# EAGLE design YAPM (EAGLE 6.3)
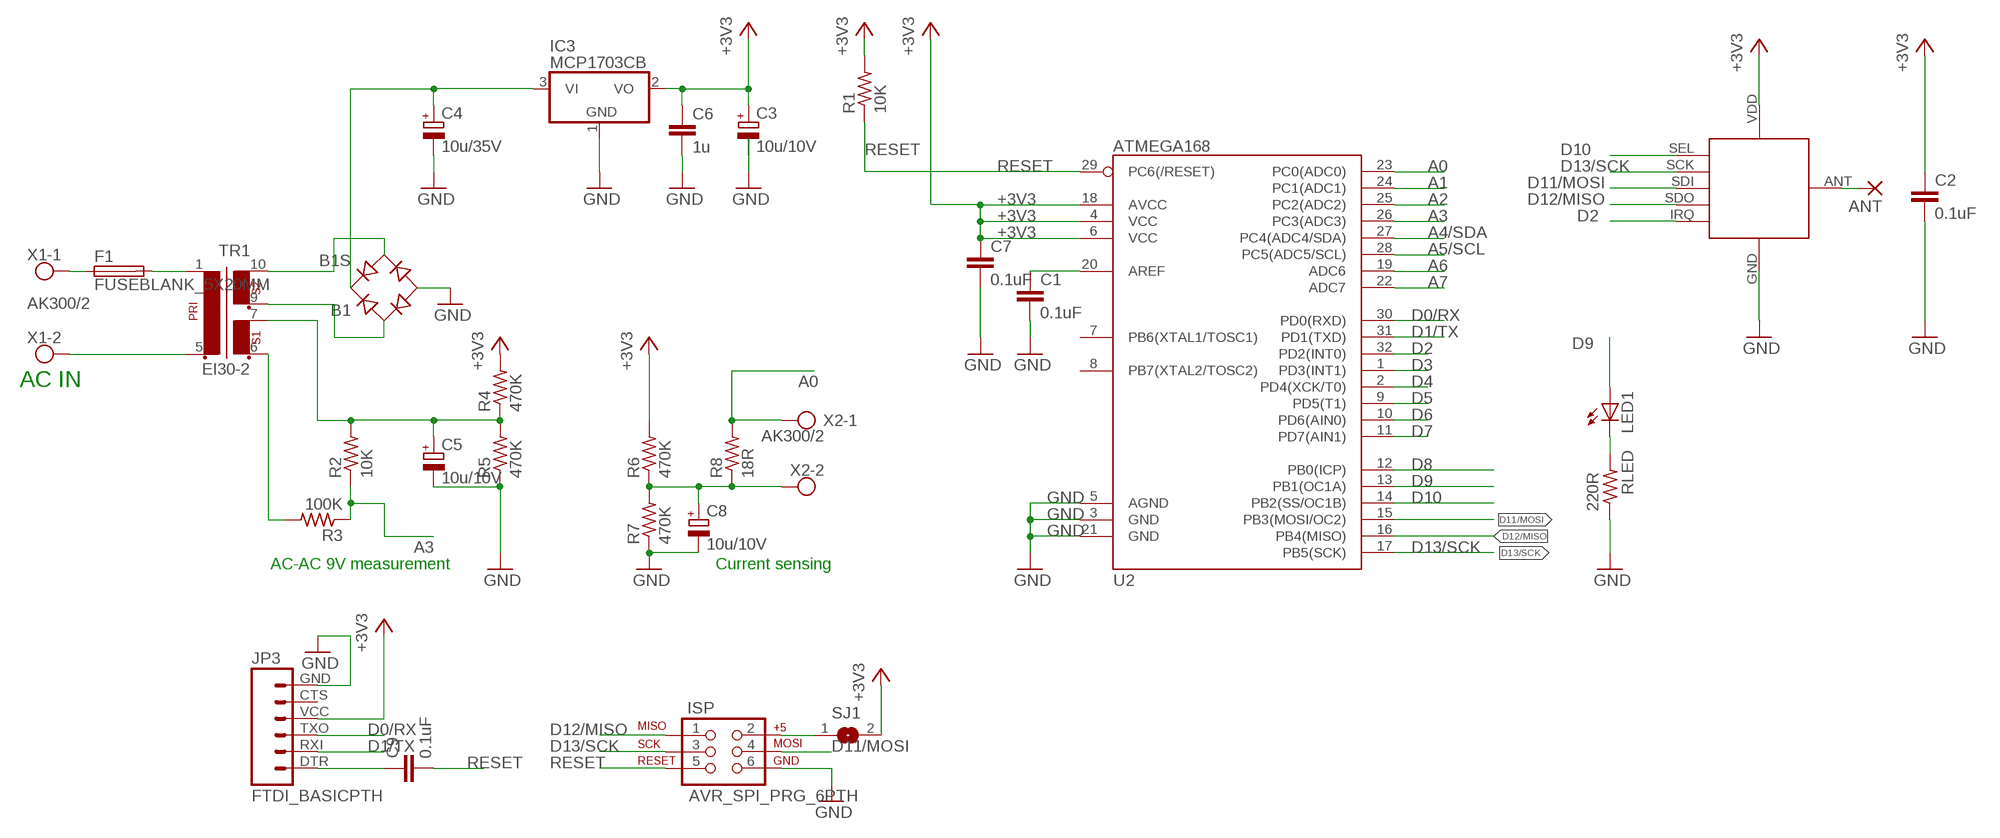
[diagram p0: schematic, sheet 1]

## Parts
ANT  1,6/0,8  [1,6/0,8]
B1  B1S  [MBS]
C1  0.1uF  C-EUC0603  [C0603]
C2  0.1uF  C-EUC0603  [C0603]
C3  10u/10V  CPOL-EUSMCA  [SMC_A]
C4  10u/35V  CPOL-EUSMCC  [SMC_C]
C5  10u/10V  CPOL-EUSMCA  [SMC_A]
C6  1u  C-EUC0603K  [C0603K]
C7  0.1uF  C-EUC0603  [C0603]
C8  10u/10V  CPOL-EUSMCA  [SMC_A]
C9  0.1uF  C-EUC0603  [C0603]
F1  FUSEBLANK_5X20MM  [FUSE_HOLDER_5X20MM]
IC3  MCP1703CB  [SOT23]
ISP  AVR_SPI_PRG_6PTH  [2X3]
JP3  FTDI_BASICPTH  [FTDI_BASIC]
LED1  LEDSML0603  [SML0603]
R1  10K  R-US_R0603  [R0603]
R2  10K  R-US_R0603  [R0603]
R3  100K  R-US_R0603  [R0603]
R4  470K  R-US_R0603  [R0603]
R5  470K  R-US_R0603  [R0603]
R6  470K  R-US_R0603  [R0603]
R7  470K  R-US_R0603  [R0603]
R8  18R  R-US_R0603  [R0603]
RFM12B1  RFM12B_MINPADS  [RFM12B-MINPADS]
RLED  220R  R-US_R0603  [R0603]
SJ1  SJ  [SJ]
TR1  EI30-2  [EI30-2]
U2  ATMEGA168  [TQFP32-08]
X1  AK300/2  [AK300/2]
X2  AK300/2  [AK300/2]

## Nets
+3V3 [power]: C2.1 C3.+ C6.1 C7.1 IC3.2(VO) JP3.VCC R1.2 R4.2 R6.2 RFM12B1.VDD SJ1.2 U2.4(VCC) U2.6(VCC) U2.18(AVCC)
+5V: ISP.2 SJ1.1
A0 [power]: R8.2 U2.23(PC0(ADC0)) X2.1
A1: U2.24(PC1(ADC1))
A2: U2.25(PC2(ADC2))
A3: R2.1 R3.1 U2.26(PC3(ADC3))
A4/SDA: U2.27(PC4(ADC4/SDA))
A5/SCL: U2.28(PC5(ADC5/SCL))
A6: U2.19(ADC6)
A7: U2.22(ADC7)
D0/RX: JP3.TXO U2.30(PD0(RXD))
D1/TX: JP3.RXI U2.31(PD1(TXD))
D2: RFM12B1.IRQ U2.32(PD2(INT0))
D3: U2.1(PD3(INT1))
D4: U2.2(PD4(XCK/T0))
D5: U2.9(PD5(T1))
D6: U2.10(PD6(AIN0))
D7: U2.11(PD7(AIN1))
D8: U2.12(PB0(ICP))
D9: LED1.A U2.13(PB1(OC1A))
D10: RFM12B1.SEL U2.14(PB2(SS/OC1B))
D11/MOSI: ISP.4 RFM12B1.SDI(SDI/MOSI) U2.15(PB3(MOSI/OC2))
D12/MISO: ISP.1 RFM12B1.SDO(SDO/MISO) U2.16(PB4(MISO))
D13/SCK: ISP.3 RFM12B1.SCK U2.17(PB5(SCK))
GND [power]: B1.- C1.2 C2.2 C3.- C4.- C5.- C6.2 C7.2 C8.- IC3.1(GND) ISP.6 JP3.GND R5.1 R7.1 RFM12B1.GND RLED.1 U2.3(GND) U2.5(AGND) U2.21(GND)
N$1 [220V]: F1.2 TR1.1
N$2 [220V]: F1.1 X1.1
N$3 [power]: B1.AC2 TR1.10
N$4 [power]: B1.AC1 TR1.9
N$5 [power]: B1.+ C4.+ IC3.3(VI)
N$6: C1.1 U2.20(AREF)
N$7 [power]: ANT.1(P) RFM12B1.ANT
N$8: LED1.C RLED.2
N$10 [power]: C8.+ R6.1 R7.2 R8.1 X2.2
N$11: C9.1 JP3.DTR
N$16 [power]: C5.+ R2.2 R4.1 R5.2 TR1.7
N$21 [power]: R3.2 TR1.6
N$27 [220V]: TR1.5 X1.2
RESET: C9.2 ISP.5 R1.1 U2.29(PC6(/RESET))
Unconnected: JP3.CTS U2.7(PB6(XTAL1/TOSC1)) U2.8(PB7(XTAL2/TOSC2))

## Notes on the sheet
- AC IN
- AC-AC 9V measurement | Current sensing

## Library data of the parts
ANT = JeeLabs:1,6/0,8: THROUGH-HOLE PAD
B1 = rectifier:B*S: Surface Mount Glass Passivated Bridge Rectifiers Source: Comchip Bridge Rectifiers B05S-G_B10S-G.pdf
C1 C7 C9 = resistor:C-EU: CAPACITOR, European symbol
C2 C6 = rcl:C-EU: CAPACITOR, European symbol
C3-C5 C8 = rcl:CPOL-EU: POLARIZED CAPACITOR, European symbol
F1 = fuse:FUSE: Fuse; OC_FARNELL: unknown; OC_NEWARK: unknown
IC3 = linear:MCP1703: 250 mA, 16V, Low Quiescent Current LDO Regulator Source: http://ww1.microchip.com/downloads/en/DeviceDoc/22049b.pdf
ISP = SparkFun:AVR_SPI_PRG_6: AVR ISP 6 Pin This is the reduced ISP connector for AVR programming. Common on Arduino. This footprint will take up less PCB space and can be used with a 10-pin to 6-pin adapter such as SKU: BOB-08508
JP3 = SparkFun:FTDI_BASIC: FTDI Basic: 3.3V and 5V
LED1 = led:LED: LED OSRAM: - CHIPLED LG R971, LG N971, LY N971, LG Q971, LY Q971, LO R971, LY R971 LH N974, LH R974 LS Q976, LO Q976, LY Q976 LO Q996 - Hyper CHIPLED LW Q18S LB Q993, LB Q99A, LB R99A - SideLED LS A670, LO A670, LY A670, LG A670, LP A670 LB A673, LV A673, LT A673, LW A673 LH A674 LY A675 LS A676, LA A676, LO A676, LY A676, LW A676 LS A679, LY A679, LG A679 - Hyper Micro SIDELED® LS Y876, LA Y876, LO Y876, LY Y876 LT Y87S - SmartLED LW L88C, LW L88S LB L89C, LB L89S, LG L890 LS L89K, LO L89K, LY L89K LS L896, LA L896, LO L896, LY L896 - TOPLED LS T670, LO T670, LY T670, LG T670, LP T670 LSG T670, LSP T670, LSY T670, LOP T670, LYG T670 LG T671, LOG T671, LSG T671 LB T673, LV T673, LT T673, LW T673 LH T674 LS T676, LA T676, LO T676, LY T676, LB T676, LH T676, LSB T676, LW T676 LB T67C, LV T67C, LT T67C, LS T67K, LO T67K, LY T67K, LW E67C LS E67B, LA E67B, LO E67B, LY E67B, LB E67C, LV E67C, LT E67C LW T67C LS T679, LY T679, LG T679 LS T770, LO T770, LY T770, LG T770, LP T770 LB T773, LV T773, LT T773, LW T773 LH T774 LS E675, LA E675, LY E675, LS T675 LS T776, LA T776, LO T776, LY T776, LB T776 LHGB T686 LT T68C, LB T68C - Hyper Mini TOPLED® LB M676 - Mini TOPLED Santana® LG M470 LS M47K, LO M47K, LY M47K Source: http://www.osram.convergy.de LUXEON: - LUMILED® LXK2-PW12-R00, LXK2-PW12-S00, LXK2-PW14-U00, LXK2-PW14-V00 LXK2-PM12-R00, LXK2-PM12-S00, LXK2-PM14-U00 LXK2-PE12-Q00, LXK2-PE12-R00, LXK2-PE12-S00, LXK2-PE14-T00, LXK2-PE14-U00 LXK2-PB12-K00, LXK2-PB12-L00, LXK2-PB12-M00, LXK2-PB14-N00, LXK2-PB14-P00, LXK2-PB14-Q00 LXK2-PR12-L00, LXK2-PR12-M00, LXK2-PR14-Q00, LXK2-PR14-R00 LXK2-PD12-Q00, LXK2-PD12-R00, LXK2-PD12-S00 LXK2-PH12-R00, LXK2-PH12-S00 LXK2-PL12-P00, LXK2-PL12-Q00, LXK2-PL12-R00 Source: www.luxeon.com KINGBRIGHT: KA-3528ASYC Source: www.kingbright.com
R1-R8 RLED = adafruit:R-US_: RESISTOR, American symbol
RFM12B1 = LowPowerLab:RFM12B_MINPADS
SJ1 = jumper:SJ: SMD solder JUMPER
TR1 = trafo:EI30-2: TRANSFORMER 1 primary winding, 2 secondary windings ERA
U2 = SparkFun:ATMEGA168
X1 X2 = con-ptr500:AK300/2: CONNECTOR; OC_FARNELL: unknown; OC_NEWARK: unknown

## Net classes
0 default: width 0.203 mm, drill 0.6 mm, clearance 0.203 mm
1 power: width 0.381 mm, drill 0.6 mm, clearance 0.305 mm
2 220V: width 2.032 mm, drill 0.8 mm, clearance 2.032 mm

## Board
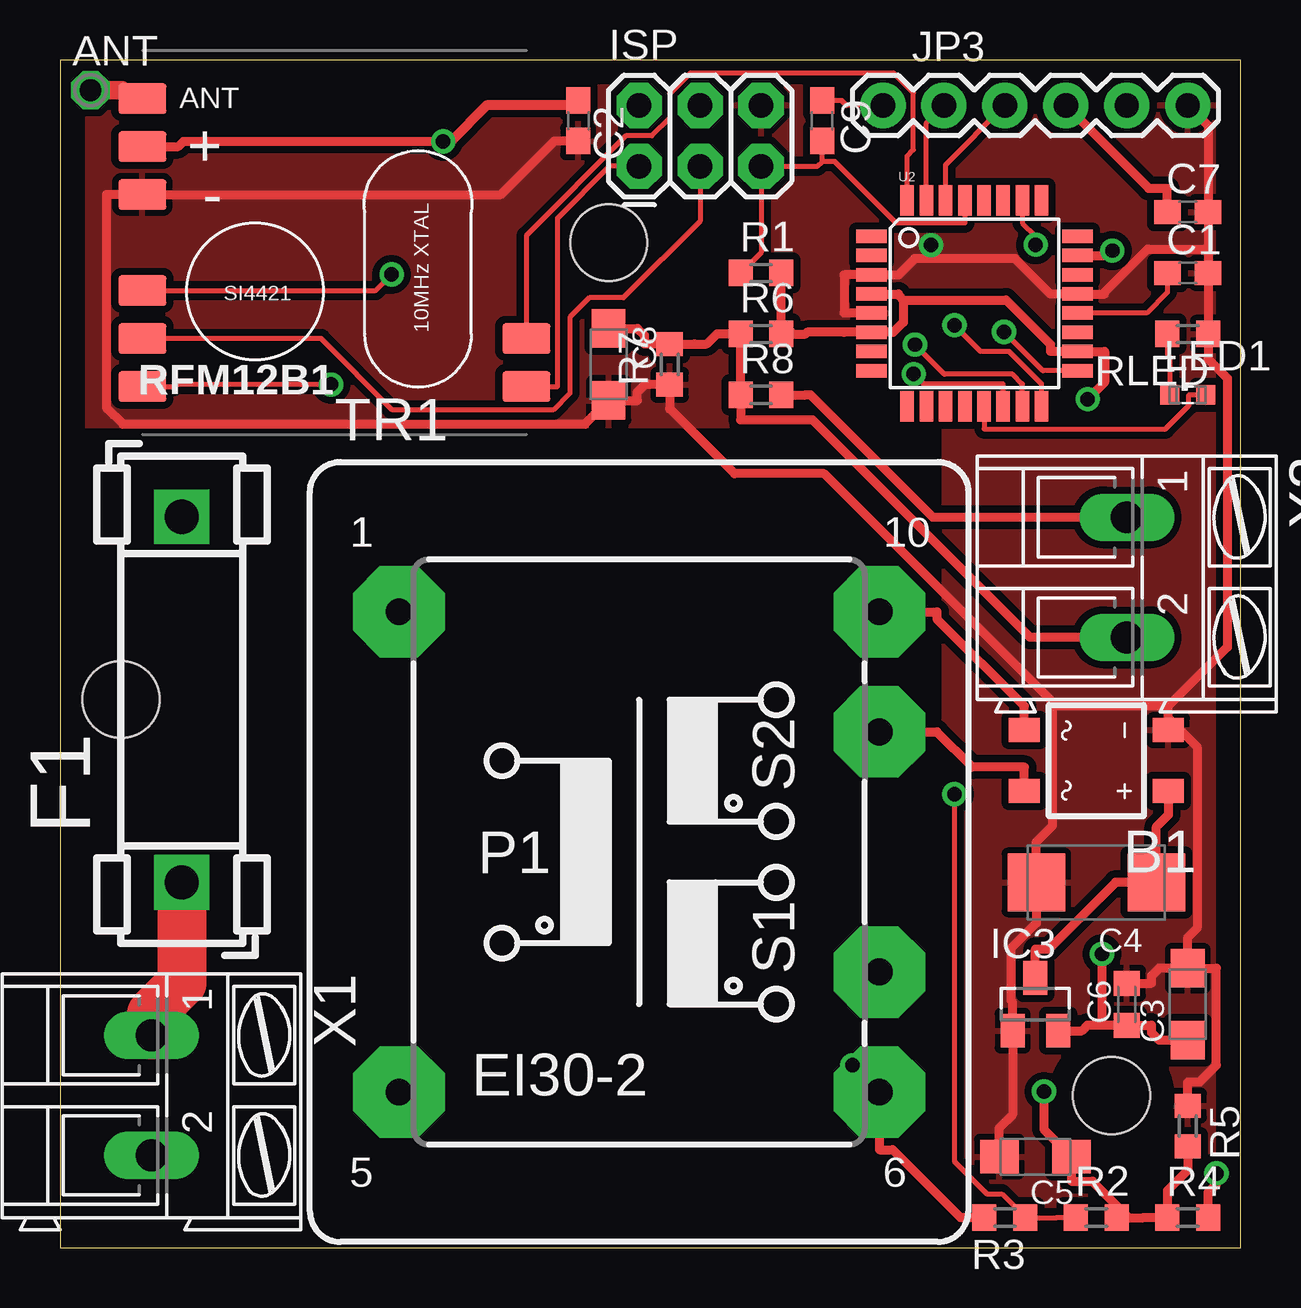
[diagram p1: board, top side]
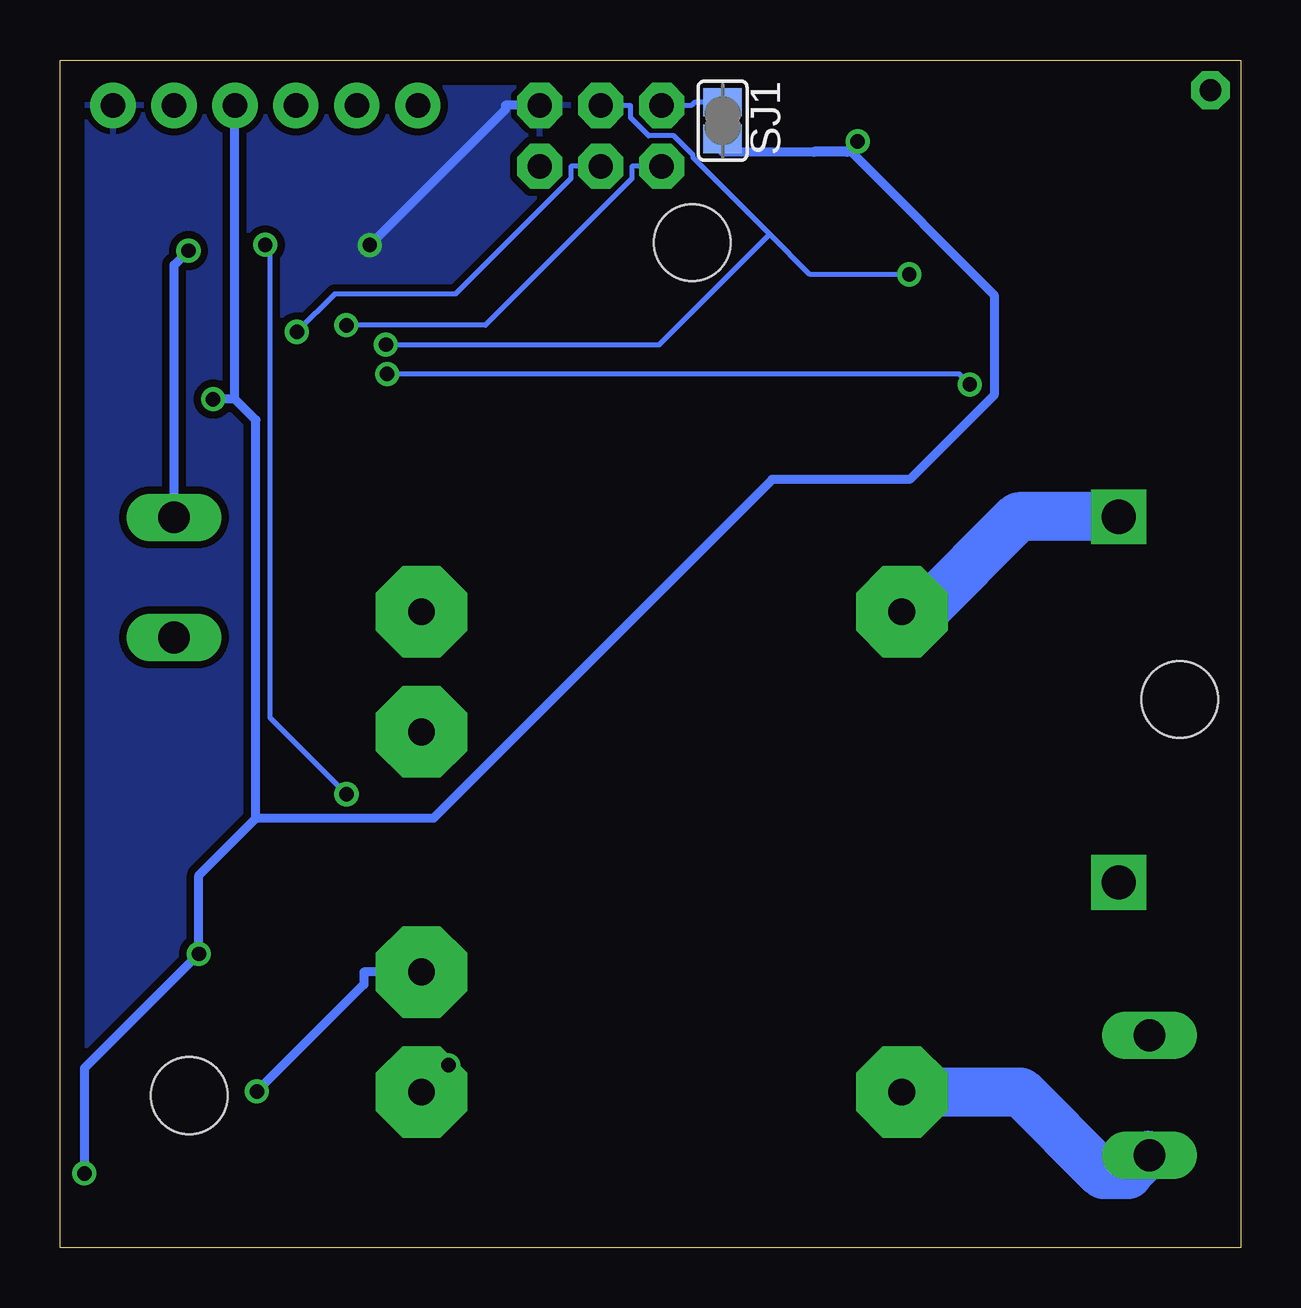
[diagram p2: board, bottom side, seen from below]

Size 49.2 x 49.52 mm. Coordinates in mm from the lower left corner, seen from the top.
Outline: 0,0 49.2,0 49.2,49.52 0,49.52 0,0
Copper layers (1*16): Top 0.035mm / dielectric 1.5mm / Bottom 0.035mm
Design rules: minimum track width 10mil, minimum drill 24mil, track to track 8mil, track to pad 8mil, pad to pad 8mil, via to via 8mil, smd to smd 8mil, copper to edge 40mil, drill to drill 8mil, minimum pad ring 10mil, minimum via ring 8mil, stop-mask expansion 4mil, vias tented up to drill 0mil, thermal gap 10mil
Holes 3.2 mm at 43.81,6.35 22.86,41.91 2.54,22.86

### Footprints (pad centres in the part's own frame; a part is rotated, then mirrored left to right if it is on the bottom)
1,6/0,8 = drill 0.9 pad 1.6 octagon: 1 0,0
MBS = smd 1 x 1.3: + -1.27,-3; - 1.27,-3; AC1 -1.27,3; AC2 1.27,3
C0603 = smd 1.1 x 1: 1 -0.85,0; 2 0.85,0
SMC_A = smd 1.6 x 1.4: + -1.5,0; - 1.5,0
SMC_C = smd 2.4 x 2.4: + -2.5,0; - 2.5,0
C0603K = smd 1.05 x 1.08: 1 -0.875,0; 2 0.875,0
FUSE_HOLDER_5X20MM = drill 1.422 pad 2.286 square: 1 0,0; 2 15.24,0
SOT23 = smd 1 x 1.4: 1 -0.95,-1.1; 2 0.95,-1.1; 3 0,1.1
2X3 = drill 1.016 pad 1.88 octagon: 1 0,0; 2 0,2.54; 3 2.54,0; 4 2.54,2.54; 5 5.08,0; 6 5.08,2.54
FTDI_BASIC = drill 1.016 pad 1.88: CTS 10.16,0; DTR 0,0; GND 12.7,0; RXI 2.54,0; TXO 5.08,0; VCC 7.62,0
SML0603 = smd 0.8 x 0.8: A 0.75,0; C -0.75,0
R0603 = smd 1 x 1.1: 1 -0.85,0; 2 0.85,0
RFM12B-MINPADS = smd 2 x 1.27: ANT 8,-6; GND 8,-2; IRQ -8,4; SCK 8,4; SDI 8,2; SDO -8,6; SEL 8,6; VDD 8,-4
SJ = smd 1.168 x 1.6: 1 -0.762,0; 2 0.762,0
EI30-2 = drill 1.118 pad 3.81 octagon: 1 -10.008,10.008; 5 -10.008,-10.008; 6 10.008,-10.008; 7 10.008,-5.004; 9 10.008,5.004; 10 10.008,10.008
TQFP32-08 = smd 1.27 x 0.559: 1 -4.293,2.8; 2 -4.293,2; 3 -4.293,1.2; 4 -4.293,0.4; 5 -4.293,-0.4; 6 -4.293,-1.2; 7 -4.293,-2; 8 -4.293,-2.8; 17 4.293,-2.8; 18 4.293,-2; 19 4.293,-1.2; 20 4.293,-0.4; 21 4.293,0.4; 22 4.293,1.2; 23 4.293,2; 24 4.293,2.8 | smd 0.559 x 1.27: 9 -2.8,-4.293; 10 -2,-4.293; 11 -1.2,-4.293; 12 -0.4,-4.293; 13 0.4,-4.293; 14 1.2,-4.293; 15 2,-4.293; 16 2.8,-4.293; 25 2.8,4.293; 26 2,4.293; 27 1.2,4.293; 28 0.4,4.293; 29 -0.4,4.293; 30 -1.2,4.293; 31 -2,4.293; 32 -2.8,4.293
AK300/2 = drill 1.321 long: 1 -2.515,0; 2 2.489,0

### Placement (x,y rotation side)
ANT  1.27,48.26 0 top
B1  43.18,20.32 90 top
C1  46.99,40.64 0 top
C2  21.59,46.99 270 top
C3  46.99,10.16 90 top
C4  43.18,15.24 180 top
C5  40.64,3.81 180 top
C6  44.45,10.16 90 top
C7  46.99,43.18 0 top
C8  22.86,36.83 270 top
C9  31.75,46.99 270 top
F1  5.08,15.24 90 top
IC3  40.64,10.16 0 top
ISP  24.13,45.09 0 top
JP3  34.29,47.62 0 top
LED1  46.99,35.56 0 top
R1  29.21,40.64 0 top
R2  43.18,1.27 0 top
R3  39.37,1.27 180 top
R4  46.99,1.27 0 top
R5  46.99,5.08 270 top
R6  29.21,38.1 0 top
R7  25.4,36.83 90 top
R8  29.21,35.56 0 top
RFM12B1  11.43,41.91 180 top
RLED  46.99,38.1 180 top
SJ1  21.59,46.99 270 bottom
TR1  24.13,16.51 0 top
U2  38.1,39.37 0 top
X1  3.81,6.35 270 top
X2  44.45,27.94 270 top

### Tracks (layer width: path | path; a pad name or v marks a point on that pad's centre or on a via)
+3V3  (via drill 0.6 pad 1.01)
  Top 0.381: v42.82,35.38 43.52,36.09 43.52,37.37 U2.18 41.26,37.37 41.26,37.68 39.43,39.51 35.14,39.51 | IC3.2 42.59,9.06 42.81,9.29 43.41,9.29 | v43.41,12.26 43.41,9.29 | 43.41,9.29 C6.1 45.48,9.29 45.48,8.97 45.8,8.66 46.39,8.66 46.44,8.66 C3.+ | v48.19,3.11 48.19,2.66 47.84,2.31 R4.2 | U2.4 34.94,39.77 34.94,39.71 35.14,39.51 | 35.14,39.51 35.14,38.59 34.72,38.17 U2.6 32.68,38.17 31.12,38.17 31.05,38.1 30.56,38.1 | 30.56,38.1 30.06,38.6 R1.2 | R6.2 30.56,38.1 | v15.96,46.12 5.14,46.12 4.92,45.91 RFM12B1.VDD | C7.1 46.14,44.17 45.36,44.17 JP3.VCC
  Top 0.406: C2.1 21.38,47.62 17.78,47.62 16.28,46.12 v15.96,46.12
  Bottom 0.381: 41.91,35.38 v42.82,35.38 | 41.91,35.38 JP3.VCC | 41.04,17.91 41.04,34.51 41.91,35.38 | 41.04,17.91 43.41,15.54 v43.41,12.26 48.19,7.49 v48.19,3.11 | 41.04,17.91 33.65,17.91 19.53,32.03 13.8,32.03 10.28,35.55 10.28,39.73 16.24,45.69 17.78,45.69 19.14,45.69 21.59,45.69 SJ1.2
  Bottom 0.406: v15.96,46.12 16.4,45.69 17.78,45.69
+5V
  Bottom 0.203: ISP.2 22.89,47.62 22.76,47.75 SJ1.1
A0  (via drill 0.6 pad 1.01)
  Top 0.381: v43.85,41.57 43.65,41.37 43.52,41.37 U2.23 | X2.1 36.38,30.45 31.28,35.56 31.05,35.56 | 31.05,35.56 | R8.2 31.05,35.56
  Bottom 0.381: X2.1 44.45,40.97 v43.85,41.57
A3  (via drill 0.6 pad 1.01)
  Top 0.203: v40.65,41.82 40.65,42.17 40.1,42.72 U2.26 | v37.26,18.92 37.26,3.61 38.62,2.25 39.24,2.25 R3.1 41.52,1.27 R2.1
  Bottom 0.203: v37.26,18.92 40.44,22.1 40.44,41.61 v40.65,41.82
D0/RX
  Top 0.203: U2.30 36.9,45.16 JP3.TXO
D1/TX
  Top 0.203: U2.31 36.1,46.9 JP3.RXI
D2
  Top 0.203: U2.32 35.3,45.51 35.56,45.77 35.56,48.15 34.73,48.98 26.26,48.98 25.4,48.12 25.4,47.09 24.66,46.35 23.58,46.35 19.43,42.2 RFM12B1.IRQ
D9
  Top 0.203: LED1.A 47.03,35.56 47.03,35.12 46.05,34.14 38.5,34.14 U2.13
D10  (via drill 0.6 pad 1.01)
  Top 0.203: v35.57,36.43 35.98,36.02 39.3,36.02 U2.14 | RFM12B1.SEL 4.74,35.91 4.82,35.99 v11.29,35.99
  Bottom 0.203: v11.29,35.99 11.73,36.43 v35.57,36.43
D11/MOSI  (via drill 0.6 pad 1.01)
  Top 0.203: v35.62,37.66 36.85,36.42 39.69,36.42 40.1,36.02 U2.15 | RFM12B1.SDI 13.14,39.91 v13.82,40.58
  Bottom 0.203: 19.63,42.25 22.82,45.45 22.82,45.56 23.62,46.35 24.67,46.35 25.43,47.11 25.43,47.62 ISP.4 | v13.82,40.58 17.96,40.58 19.63,42.25 | v35.62,37.66 24.22,37.66 19.63,42.25
D12/MISO  (via drill 0.6 pad 1.01)
  Top 0.203: v37.27,38.46 38.35,37.38 39.54,37.38 40.9,36.02 U2.16 | RFM12B1.SDO 20.73,35.91 20.73,42.94 22.89,45.09 ISP.1
  Bottom 0.203: v37.27,38.46 31.48,38.46 25.38,44.57 25.38,45.09 ISP.1
D13/SCK  (via drill 0.6 pad 1.01)
  Top 0.203: U2.17 40.95,36.57 v39.33,38.19 | ISP.3 26.67,42.81 23.47,39.61 22.06,39.61 21.24,38.8 21.24,35.63 20.55,34.93 13.85,34.93 10.88,37.91 RFM12B1.SCK
  Bottom 0.203: v39.33,38.19 37.75,39.77 32.73,39.77 27.91,44.58 27.91,45.09 ISP.3
GND  (via drill 0.6 pad 1.01)
  Top 0.381: C6.2 45.48,11.04 45.48,11.35 45.8,11.66 C3.- | C3.- 48.19,11.66 48.19,7.62 47.49,6.92 46.99,6.92 R5.1 | C3.- 46.99,12.96 47.38,13.34 47.38,20.89 46.18,22.09 | 46.18,22.09 46.18,22.59 | B1.- 46.18,22.09 | 41.36,22.59 41.36,22.75 31.84,32.27 28.11,32.27 25.4,34.98 R7.1 24.36,35.98 24.05,35.68 24.05,35.33 23.46,35.33 23.28,35.33 C8.- 21.87,34.34 2.62,34.34 1.94,35.03 1.94,43.91 RFM12B1.GND 18.36,43.91 20.59,46.14 C2.2 | 41.36,22.59 41.36,17.62 40.68,16.93 C4.- 40.68,13.54 39.62,12.49 39.62,10.32 39.69,10.26 IC3.1 39.69,5.55 39.14,5 C5.- | 46.18,22.59 41.36,22.59 | 46.18,22.59 48.64,25.04 48.64,36.26 47.84,37.05 RLED.1 C1.2 47.84,41.64 | U2.5 32.68,38.97 32.68,40.57 U2.3 34.12,40.57 34.94,40.57 35.61,41.24 36.29,41.24 | 36.29,41.24 39.79,41.24 41.26,39.77 41.83,39.77 U2.21 43.52,39.77 43.52,39.83 45.32,41.64 47.84,41.64 | 47.84,41.64 C7.2 47.84,46.77 JP3.GND | 36.29,41.24 v36.29,41.81
  Bottom 0.381: v36.29,41.81 30.64,47.45 30.64,47.62 ISP.6
  pour Bottom: 36.83,0 49.53,0 49.53,49.53 0,49.53 0,34.29 36.83,34.29
  pour Top: 36.83,0 49.53,0 49.53,49.53 0,49.53 0,34.29 36.83,34.29
N$1
  Bottom 2.032: F1.2 9.27,30.48 13.23,26.52 TR1.1
N$2
  Top 2.032: F1.1 5.08,11.05 3.81,9.78 X1.1
N$3
  Top 0.381: B1.AC2 40.18,22.59 36.54,26.23 36.54,26.52 TR1.10
N$4
  Top 0.381: B1.AC1 40.18,20.05 38.01,20.05 36.54,21.51 TR1.9
N$5
  Top 0.381: IC3.3 40.64,12.46 41.2,12.46 43.98,15.24 C4.+ 45.68,17.55 46.18,18.05 B1.+
N$6
  Top 0.203: C1.1 46.14,39.84 45.27,38.97 U2.20
N$7
  Top 0.381: RFM12B1.ANT 2.92,47.91 2.57,48.26
  Top 0.762: ANT.1 2.57,48.26
N$8
  Top 0.203: RLED.2 46.14,37.24 46.24,37.15 LED1.C
N$9  (via drill 0.6 pad 0.61)
  other vias: 33.02,7.62
N$10
  Top 0.381: X2.2 40.42,25.45 31.35,34.52 28.36,34.52 R8.1 R6.1 27.36,38.1 26.95,37.68 26.45,37.68 R7.2 24.36,37.68 24.36,38.03 24.05,38.33 C8.+
N$11
  Top 0.203: C9.1 32.55,47.84 32.77,47.62 JP3.DTR
N$16  (via drill 0.6 pad 1.01)
  Top 0.381: v41,6.52 41,4.95 C5.+ 42.14,2.79 43.01,2.79 44.53,1.27 | 44.53,1.27 45.15,1.27 R4.1 46.14,2.38 46.99,3.23 R5.2 | R2.2 44.53,1.27
  Bottom 0.381: TR1.7 36.54,11.51 36.54,10.98 v41,6.52
N$21
  Top 0.381: R3.2 37.52,1.27 34.69,4.1 34.14,4.1 TR1.6
N$27
  Bottom 1.981: 4.71,3.06 3.9,3.86
  Bottom 2.032: TR1.5 9.17,6.5 5.72,3.06 4.71,3.06 | X1.2 3.9,3.86
RESET
  Top 0.203: 31.75,45.28 31.55,45.09 ISP.5 29.21,41.49 R1.1 | 31.75,45.28 C9.2 | U2.29 37.7,42.72 34.85,42.72 32.29,45.28 31.75,45.28